# EAGLE design Bunza-DCC-Front-End (EAGLE 7.7.0)
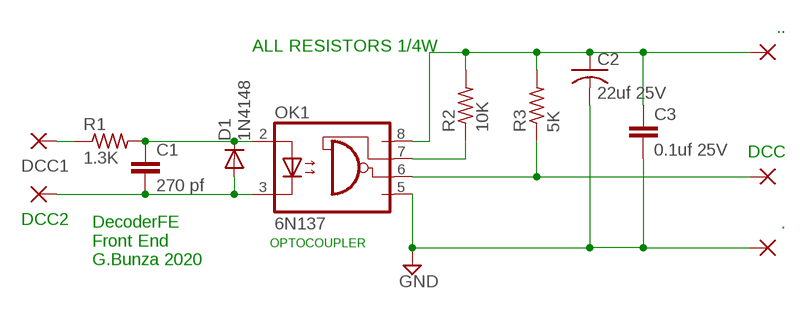
[diagram p0: schematic, sheet 1]

## Parts
.  2,15/1,0  [2,15/1,0]
..  2,15/1,0  [2,15/1,0]
C1  270 pf  CAP_  [AXIAL-5MM]
C2  22uf 25V  C-US050-035X075  [C050-035X075]
C3  0.1uf 25V  CAP_  [AXIAL-5MM]
D1  1N4148  1N4148DO35-7  [DO35-7]
DCC  2,15/1,0  [2,15/1,0]
DCC1  2,15/1,0  [2,15/1,0]
DCC2  2,15/1,0  [2,15/1,0]
OK1  6N137  [DIL08]
R1  1.3K  R-US_0204/7  [0204/7]
R2  10K  R-US_0204/7  [0204/7]
R3  5K  R-US_0204/7  [0204/7]

## Nets
GND: ..1(P) C2.2 C3.P$2 OK1.5(GND)
N$1: DCC1.1(P) R1.1
N$2: DCC.1(P) OK1.6(VO) R3.1
N$13: OK1.7(VE) R2.1
N$33: ...1(P) C2.1 C3.P$1 OK1.8(VCC) R2.2 R3.2
N$35: C1.P$1 D1.C OK1.2(A) R1.2
N$39: C1.P$2 D1.A DCC2.1(P) OK1.3(C)

## Notes on the sheet
- ALL RESISTORS 1/4W
- OPTOCOUPLER
- DecoderFE
  Front End
  G.Bunza 2020

## Library data of the parts
. .. DCC DCC1 DCC2 = wirepad:2,15/1,0: THROUGH-HOLE PAD
C1 C3 = SparkFun-Capacitors:CAP: Capacitor Standard 0603 ceramic capacitor, and 0.1" leaded capacitor.
C2 = rcl:C-US: CAPACITOR, American symbol
D1 = diode:1N4148: DIODE high speed (Philips)
OK1 = optocoupler:6N137: MOTOROLA OPTO COUPLER; MPN: 6N137; OC_FARNELL: 1328376; OC_NEWARK: 52M1895
R1-R3 = rcl:R-US_: RESISTOR, American symbol

## Board
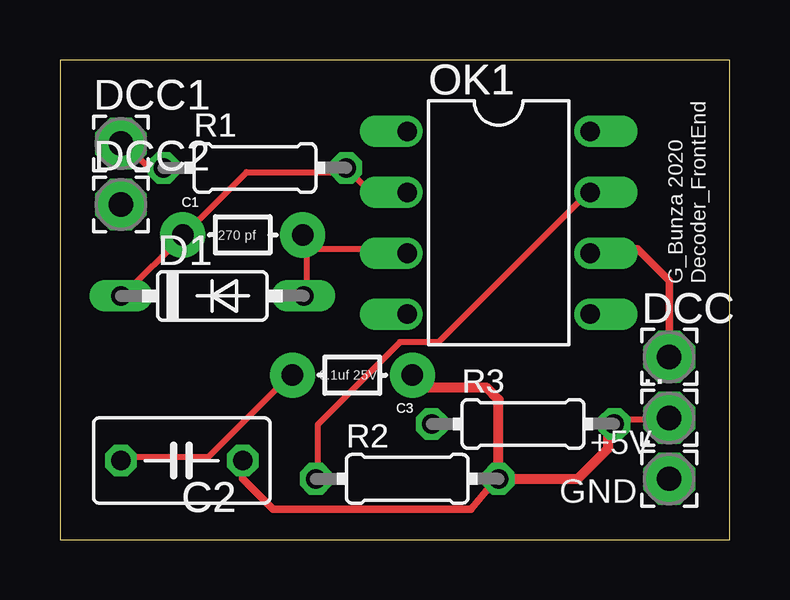
[diagram p1: board, top side]
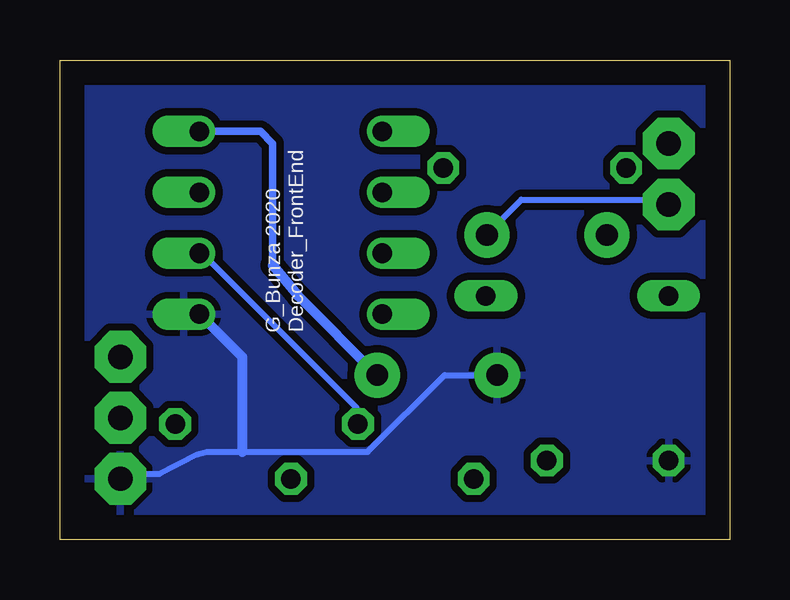
[diagram p2: board, bottom side, seen from below]

Size 27.92 x 19.99 mm. Coordinates in mm from the lower left corner, seen from the top.
Outline: 0,0 27.92,0 27.92,19.99 0,19.99 0,0
Copper layers (1*16): Top 0.035mm / dielectric 1.5mm / Bottom 0.035mm
Design rules "default": minimum track width 10mil, minimum drill 24mil, track to track 8mil, track to pad 8mil, pad to pad 8mil, via to via 8mil, smd to smd 8mil, copper to edge 40mil, drill to drill 8mil, minimum pad ring 10mil, minimum via ring 8mil, stop-mask expansion 4mil, vias tented up to drill 0mil, thermal gap 10mil

### Footprints (pad centres in the part's own frame; a part is rotated, then mirrored left to right if it is on the bottom)
2,15/1,0 = drill 1.016 pad 2.159 octagon: 1 0,0
AXIAL-5MM = drill 0.9 pad 1.88: P$1 -2.5,0; P$2 2.5,0
C050-035X075 = drill 0.813 octagon: 1 -2.54,0; 2 2.54,0
DO35-7 = drill 0.813 long: A 3.81,0; C -3.81,0
DIL08 = drill 0.813 offset: 1 -3.81,-3.81; 2 -1.27,-3.81; 3 1.27,-3.81; 4 3.81,-3.81; 5 3.81,3.81; 6 1.27,3.81; 7 -1.27,3.81; 8 -3.81,3.81
0204/7 = drill 0.813 octagon: 1 -3.81,0; 2 3.81,0

### Placement (x,y rotation side)
.  25.4,2.54 0 top
..  25.4,5.08 0 top
C1  7.62,12.7 0 top
C2  5.08,3.3 180 top
C3  12.19,6.86 180 top
D1  6.35,10.16 0 top
DCC  25.4,7.62 0 top
DCC1  2.54,16.51 0 top
DCC2  2.54,13.97 0 top
OK1  18.29,13.21 270 top
R1  8.13,15.49 0 top
R2  14.48,2.54 0 top
R3  19.3,4.83 0 top

### Tracks (layer width: path | path; a pad name or v marks a point on that pad's centre or on a via)
GND
  Top 0.254: C2.2 2.74,3.43 6.17,3.43 9.6,6.86 C3.P$2
  Bottom 0.254: 21.95,9.37 OK1.5 | ..1 25.38,2.74 23.77,2.74 22.2,3.56 21.79,3.66 20.32,3.66 15.09,3.66 11.89,6.86 C3.P$2
  Bottom 0.406: 21.95,9.37 21.95,9.25 20.32,7.62 20.32,3.66
  pour Bottom (isolate 0.305): 0,0 27.94,0 27.94,19.68 0,19.68
N$1
  Top 0.254: R1.1 4.12,15.54 3.66,15.54 2.74,16.46 DCC1.1
N$2
  Top 0.254: 25.38,8.26 25.38,7.77 DCC.1 | 22.17,12.12 OK1.6
  Top 0.305: 22.17,12.12 24.08,12.12 25.4,10.79 DCC.1 | 25.4,8.28 25.38,8.26
  Bottom 0.254: R3.1 15.54,5.03 15.54,5.49 21.95,11.89 OK1.6
N$13
  Top 0.254: R2.1 10.74,2.74 10.74,4.8 14.17,8.23 15.77,8.23 21.95,14.4 OK1.7
N$33
  Top 0.254: ...1 25.38,5.03 23.32,5.03 R3.2 | 14.86,6.86 C3.P$1
  Top 0.305: C2.1 7.62,2.54 8.89,1.27 17.14,1.27 17.78,2.03 R2.2
  Top 0.406: R3.2 22.86,4.57 22.86,3.81 21.59,2.54 R2.2 18.29,5.84 17.78,6.35 15.24,6.35 14.73,6.86 C3.P$1
  Bottom 0.305: OK1.8 19.56,17.02 19.05,16.51 19.05,11.43
  Bottom 0.406: 19.05,11.43 17.99,10.16 C3.P$1
N$35
  Top 0.254: OK1.2 14.4,14.63 12.8,14.63 12.12,15.32 R1.2 11.89,15.32 7.77,15.32 5.26,12.8 C1.P$1 5.03,12.57 2.74,10.29 D1.C
N$39
  Top 0.254: 10.29,12.12 10.29,12.57 C1.P$2 10.29,12.12 | 10.29,12.12 10.29,10.29 D1.A | 10.29,12.12 14.4,12.12 OK1.3
  Bottom 0.254: DCC2.1 2.74,14.17 8.69,14.17 10.06,12.8 C1.P$2

### Text on the board
bPlace: G_Bunza 2020 / Decoder_FrontEnd
tNames: G_Bunza 2020 / Decoder_FrontEnd | +5V | GND
_tNames: OK1 | OK1 | DCC1 | DCC1 | R1 | R1 | DCC2 | DCC2 | C1 | C1 | D1 | D1 | DCC | DCC | C3 | C3 | R3 | R3 | .. | .. | R2 | R2 | . | . | C2 | C2